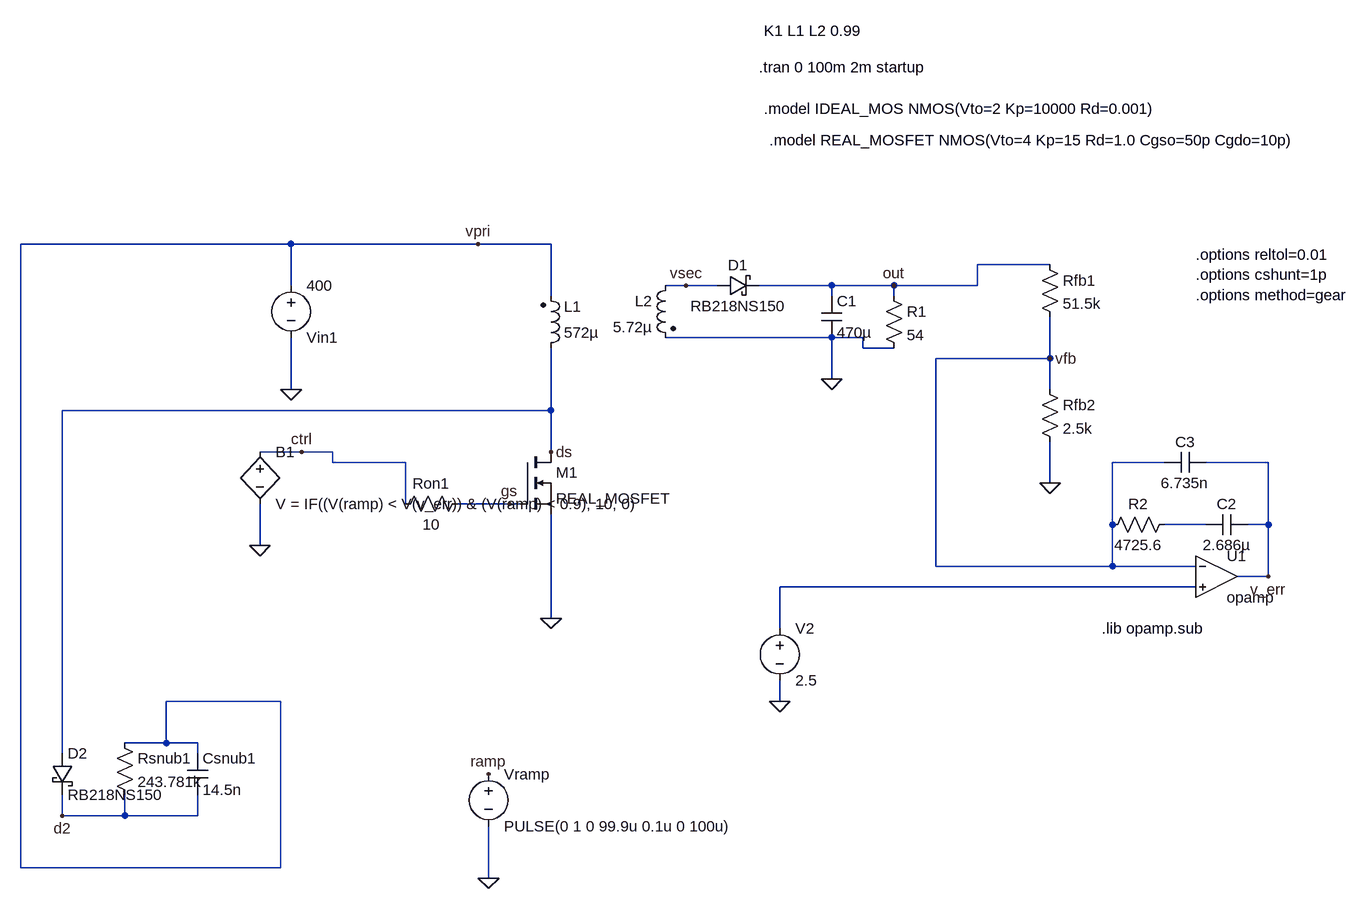
[diagram p0: schematic 10-07-26.asc]
10-07-26.asc, the LTspice schematic file:
Version 4
SHEET 1 1660 900
WIRE -272 -96 -688 -96
WIRE 16 -96 -272 -96
WIRE 128 -96 16 -96
WIRE 896 -64 784 -64
WIRE -272 -32 -272 -96
WIRE 336 -32 304 -32
WIRE 384 -32 336 -32
WIRE 560 -32 448 -32
WIRE 656 -32 560 -32
WIRE 784 -32 784 -64
WIRE 784 -32 656 -32
WIRE 128 -16 128 -96
WIRE 560 -16 560 -32
WIRE 656 -16 656 -32
WIRE 560 48 304 48
WIRE 608 48 560 48
WIRE 608 64 608 48
WIRE 656 64 608 64
WIRE 896 80 896 16
WIRE 896 80 720 80
WIRE 560 112 560 48
WIRE -272 128 -272 48
WIRE 896 128 896 80
WIRE 128 160 128 64
WIRE 128 160 -624 160
WIRE -256 224 -320 224
WIRE -208 224 -256 224
WIRE 128 224 128 160
WIRE -208 240 -208 224
WIRE -96 240 -208 240
WIRE 1072 240 992 240
WIRE 1232 240 1136 240
WIRE 896 272 896 208
WIRE -96 304 -96 240
WIRE 64 304 -16 304
WIRE 80 304 64 304
WIRE 992 336 992 240
WIRE 1136 336 1072 336
WIRE 1232 336 1232 240
WIRE 1232 336 1200 336
WIRE -320 368 -320 304
WIRE 720 400 720 80
WIRE 992 400 992 336
WIRE 992 400 720 400
WIRE 1120 400 992 400
WIRE 1232 416 1232 336
WIRE 1232 416 1184 416
WIRE 1120 432 480 432
WIRE 128 480 128 320
WIRE 480 496 480 432
WIRE -288 608 -464 608
WIRE 480 608 480 576
WIRE -464 672 -464 608
WIRE -464 672 -528 672
WIRE -416 672 -464 672
WIRE -624 688 -624 160
WIRE -416 688 -416 672
WIRE -624 784 -624 752
WIRE -528 784 -528 752
WIRE -528 784 -624 784
WIRE -416 784 -416 752
WIRE -416 784 -528 784
WIRE -688 864 -688 -96
WIRE -288 864 -288 608
WIRE -288 864 -688 864
WIRE 32 880 32 800
FLAG 560 112 0
FLAG 128 480 0
FLAG -272 128 0
FLAG 656 -32 out
FLAG -624 784 d2
FLAG 16 -96 vpri
FLAG 336 -32 vsec
FLAG -256 224 ctrl
FLAG -320 368 0
FLAG 64 304 gs
FLAG 128 224 ds
FLAG 896 272 0
FLAG 896 80 vfb
FLAG 480 608 0
FLAG 1232 416 v_err
FLAG 32 880 0
FLAG 32 720 ramp
SYMBOL ind2 112 80 M180
WINDOW 0 36 80 Left 2
WINDOW 3 36 40 Left 2
SYMATTR InstName L1
SYMATTR Value 572µ
SYMATTR Type ind
SYMBOL ind2 320 -48 M0
SYMATTR InstName L2
SYMATTR Value 5.72µ
SYMATTR Type ind
SYMBOL schottky 384 -16 R270
WINDOW 0 32 32 VTop 2
WINDOW 3 0 32 VBottom 2
SYMATTR InstName D1
SYMATTR Value RB218NS150
SYMATTR Description Diode
SYMATTR Type diode
SYMBOL cap 544 -16 R0
SYMATTR InstName C1
SYMATTR Value 470µ
SYMBOL voltage -272 -48 R0
WINDOW 0 24 96 Left 2
WINDOW 3 24 16 Left 2
WINDOW 123 0 0 Left 0
WINDOW 39 0 0 Left 0
SYMATTR InstName Vin1
SYMATTR Value 400
SYMBOL res 640 -32 R0
SYMATTR InstName R1
SYMATTR Value 54
SYMBOL schottky -640 688 R0
SYMATTR InstName D2
SYMATTR Value RB218NS150
SYMATTR Description Diode
SYMATTR Type diode
SYMBOL res -544 656 R0
SYMATTR InstName Rsnub1
SYMATTR Value 243.781k
SYMBOL cap -432 688 R0
SYMATTR InstName Csnub1
SYMATTR Value 14.5n
SYMBOL nmos 80 224 R0
SYMATTR InstName M1
SYMATTR Value REAL_MOSFET
SYMBOL res 0 288 R90
WINDOW 0 0 56 VBottom 2
WINDOW 3 32 56 VTop 2
SYMATTR InstName Ron1
SYMATTR Value 10
SYMBOL res 880 -80 R0
SYMATTR InstName Rfb1
SYMATTR Value 51.5k
SYMBOL res 880 112 R0
SYMATTR InstName Rfb2
SYMATTR Value 2.5k
SYMBOL OpAmps\\opamp 1152 352 R0
SYMATTR InstName U1
SYMBOL voltage 480 480 R0
WINDOW 123 0 0 Left 0
WINDOW 39 0 0 Left 0
SYMATTR InstName V2
SYMATTR Value 2.5
SYMBOL res 1088 320 R90
WINDOW 0 0 56 VBottom 2
WINDOW 3 32 56 VTop 2
SYMATTR InstName R2
SYMATTR Value 4725.6
SYMBOL cap 1200 320 R90
WINDOW 0 0 32 VBottom 2
WINDOW 3 32 32 VTop 2
SYMATTR InstName C2
SYMATTR Value 2.686µ
SYMBOL voltage 32 704 R0
WINDOW 123 0 0 Left 0
WINDOW 39 0 0 Left 0
SYMATTR InstName Vramp
SYMATTR Value PULSE(0 1 0 99.9u 0.1u 0 100u)
SYMBOL bv -320 208 R0
SYMATTR InstName B1
SYMATTR Value V = IF((V(ramp) < V(v_err)) & (V(ramp) < 0.9), 10, 0)
SYMBOL cap 1136 224 R90
WINDOW 0 0 32 VBottom 2
WINDOW 3 32 32 VTop 2
SYMATTR InstName C3
SYMATTR Value 6.735n
TEXT 456 -424 Left 2 !K1 L1 L2 0.99
TEXT 448 -368 Left 2 !.tran 0 100m 2m startup
TEXT 456 -304 Left 2 !.model IDEAL_MOS NMOS(Vto=2 Kp=10000 Rd=0.001)
TEXT 976 496 Left 2 !.lib opamp.sub
TEXT 464 -256 Left 2 !.model REAL_MOSFET NMOS(Vto=4 Kp=15 Rd=1.0 Cgso=50p Cgdo=10p)
TEXT 1120 -80 Left 2 !.options reltol=0.01\n.options cshunt=1p\n.options method=gear

The netlist it stands for:
* 10-07-26.asc
L1 ds vpri 572µ
L2 vsec 0 5.72µ
D1 vsec out RB218NS150
C1 out 0 470µ
Vin1 vpri 0 400
R1 out 0 54
D2 ds d2 RB218NS150
Rsnub1 vpri d2 243.781k
Csnub1 vpri d2 14.5n
M1 ds gs 0 0 REAL_MOSFET
Ron1 gs ctrl 10
Rfb1 out vfb 51.5k
Rfb2 vfb 0 2.5k
XU1 vfb N002 v_err opamp Aol=100K GBW=10Meg  ; pins invin noninvin out
V2 N002 0 2.5
R2 N001 vfb 4725.6
C2 v_err N001 2.686µ
Vramp ramp 0 PULSE(0 1 0 99.9u 0.1u 0 100u)
B1 ctrl 0 V = IF((V(ramp) < V(v_err)) & (V(ramp) < 0.9), 10, 0)
C3 v_err vfb 6.735n
.model D D
.lib standard.dio
.model NMOS NMOS
.model PMOS PMOS
.lib standard.mos
K1 L1 L2 0.99
.tran 0 100m 2m startup
.model IDEAL_MOS NMOS(Vto=2 Kp=10000 Rd=0.001)
.lib opamp.sub
.model REAL_MOSFET NMOS(Vto=4 Kp=15 Rd=1.0 Cgso=50p Cgdo=10p)
.options reltol=0.01
.options cshunt=1p
.options method=gear
.backanno
.end